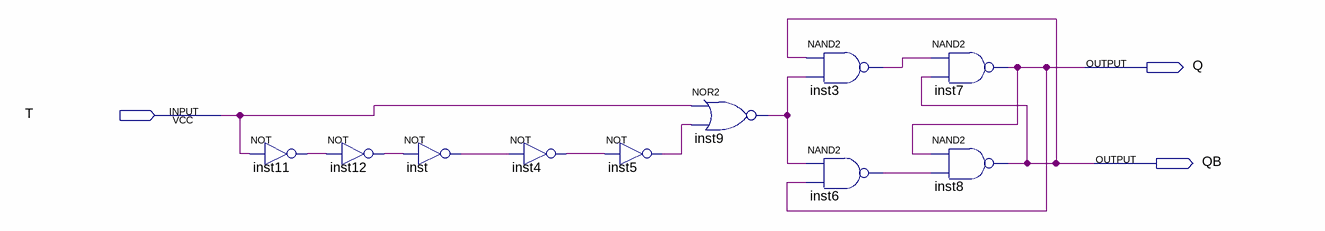
[diagram p0: schematic sheet]
// Quartus schematic figura1exp8.bdf as structural Verilog: 10 symbols, 3 pins
module figura1exp8 (
  input  T,
  output Q,
  output QB
);

  wire inst3_out, inst4_out, inst5_out, inst6_out, inst9_out, inst11_out, inst12_out, inst_out;

  not inst11 (inst11_out, T);
  not inst12 (inst12_out, inst11_out);
  not inst (inst_out, inst12_out);
  not inst4 (inst4_out, inst_out);
  not inst5 (inst5_out, inst4_out);
  nor inst9 (inst9_out, T, inst5_out);
  nand inst3 (inst3_out, QB, inst9_out);
  nand inst6 (inst6_out, inst9_out, Q);
  nand inst7 (Q, inst3_out, QB);
  nand inst8 (QB, Q, inst6_out);
endmodule
